# EAGLE board keyBoard_A (EAGLE 6.3), part 1 of 2
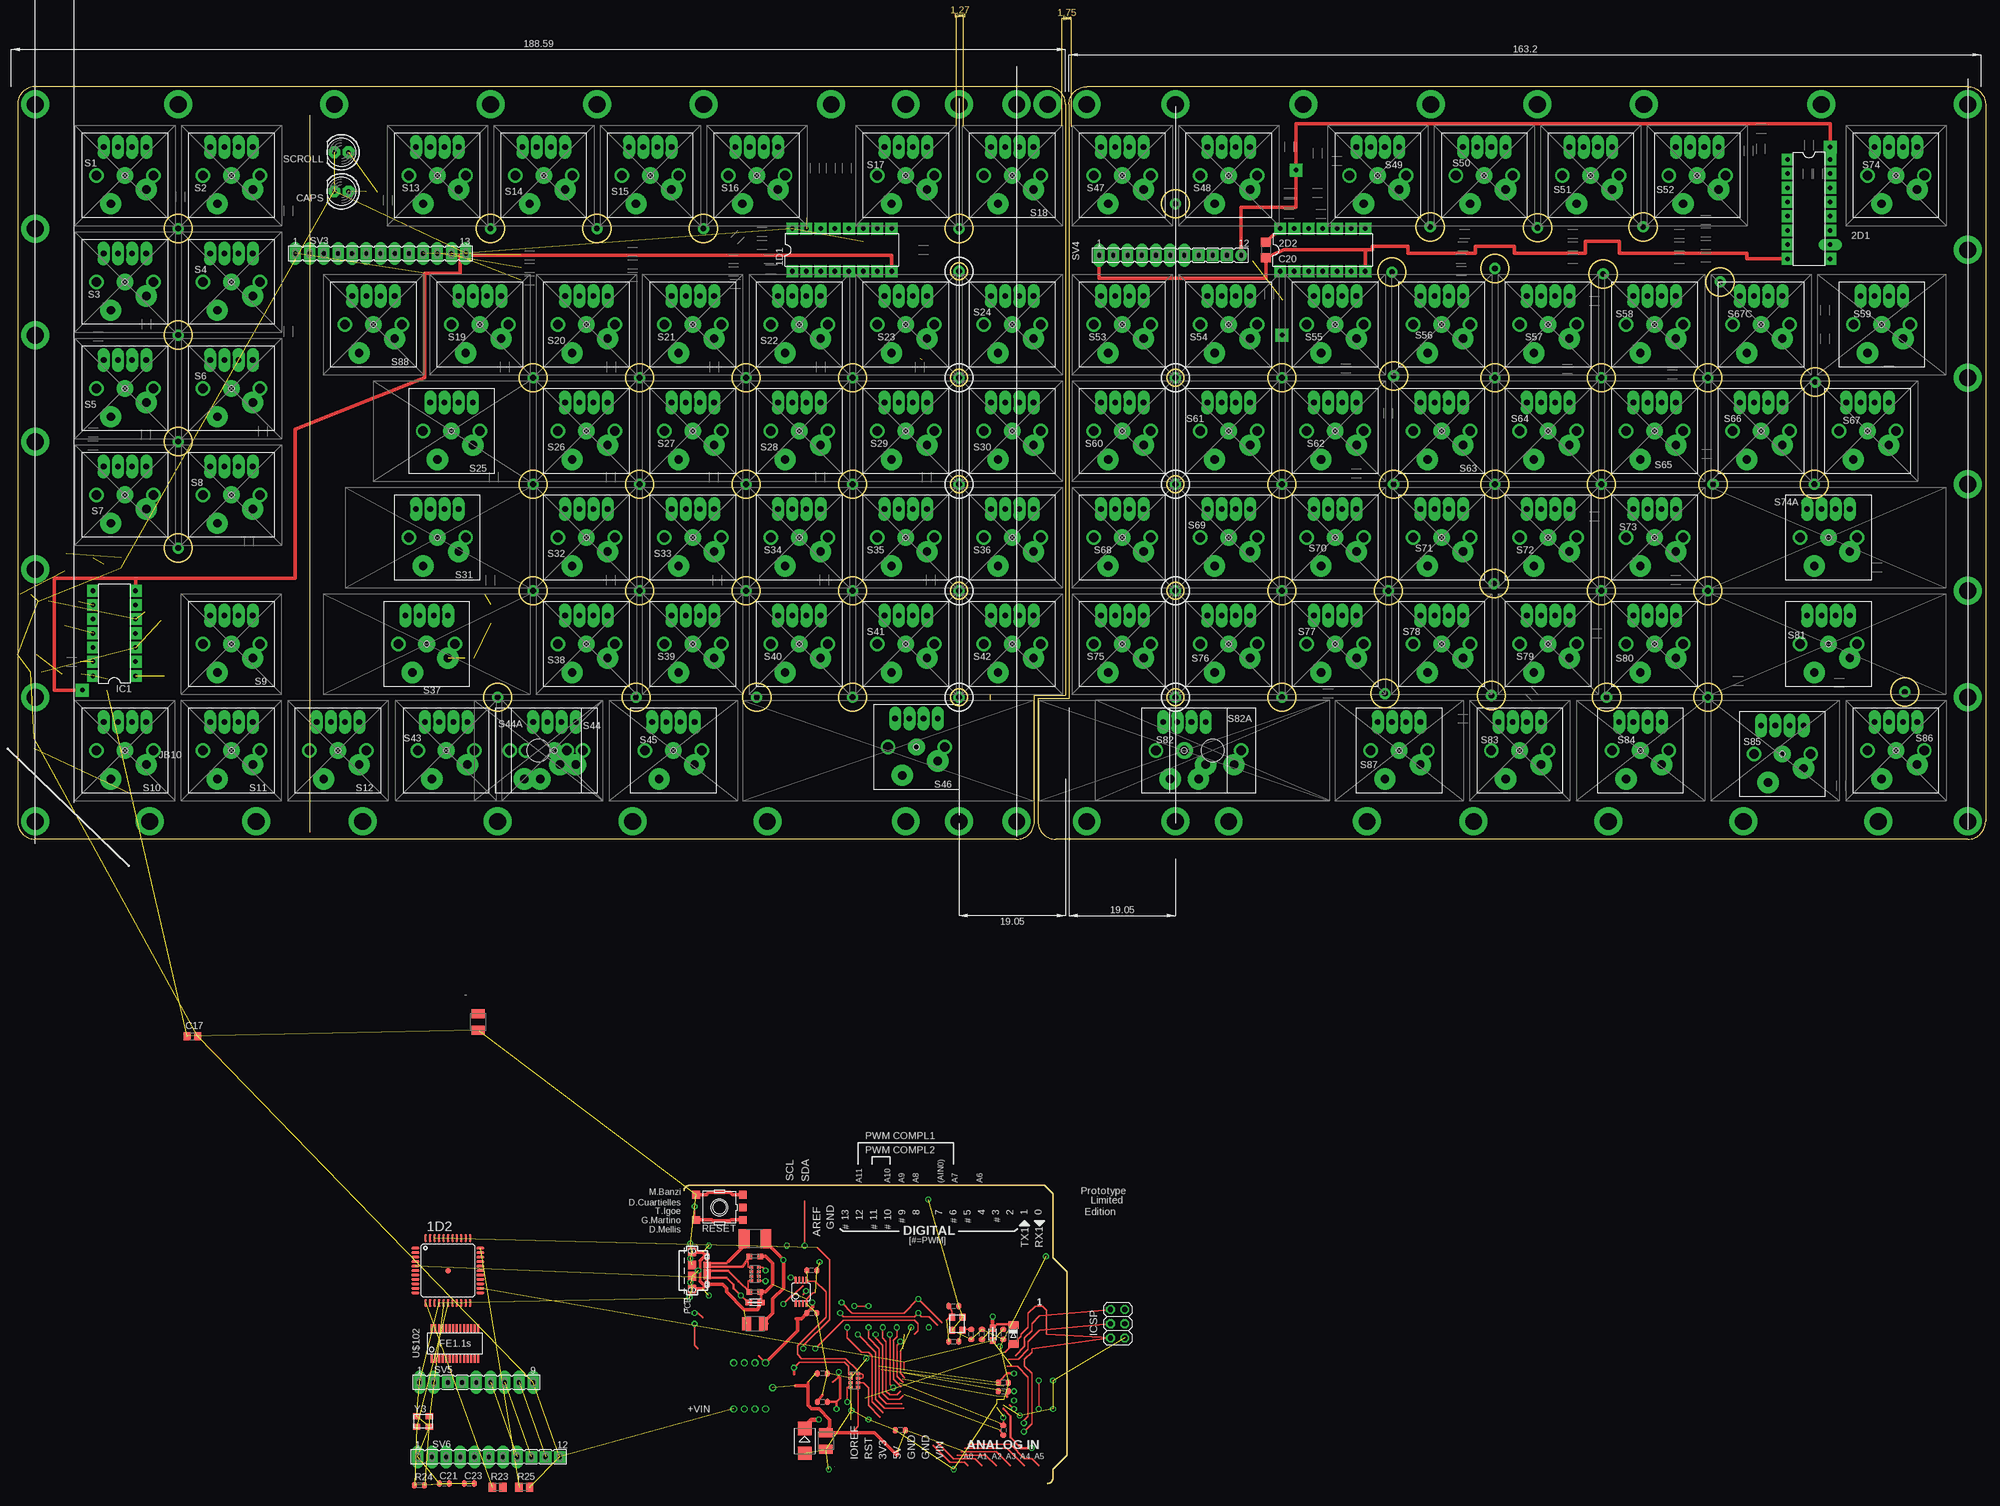
[diagram p4: board, top side]
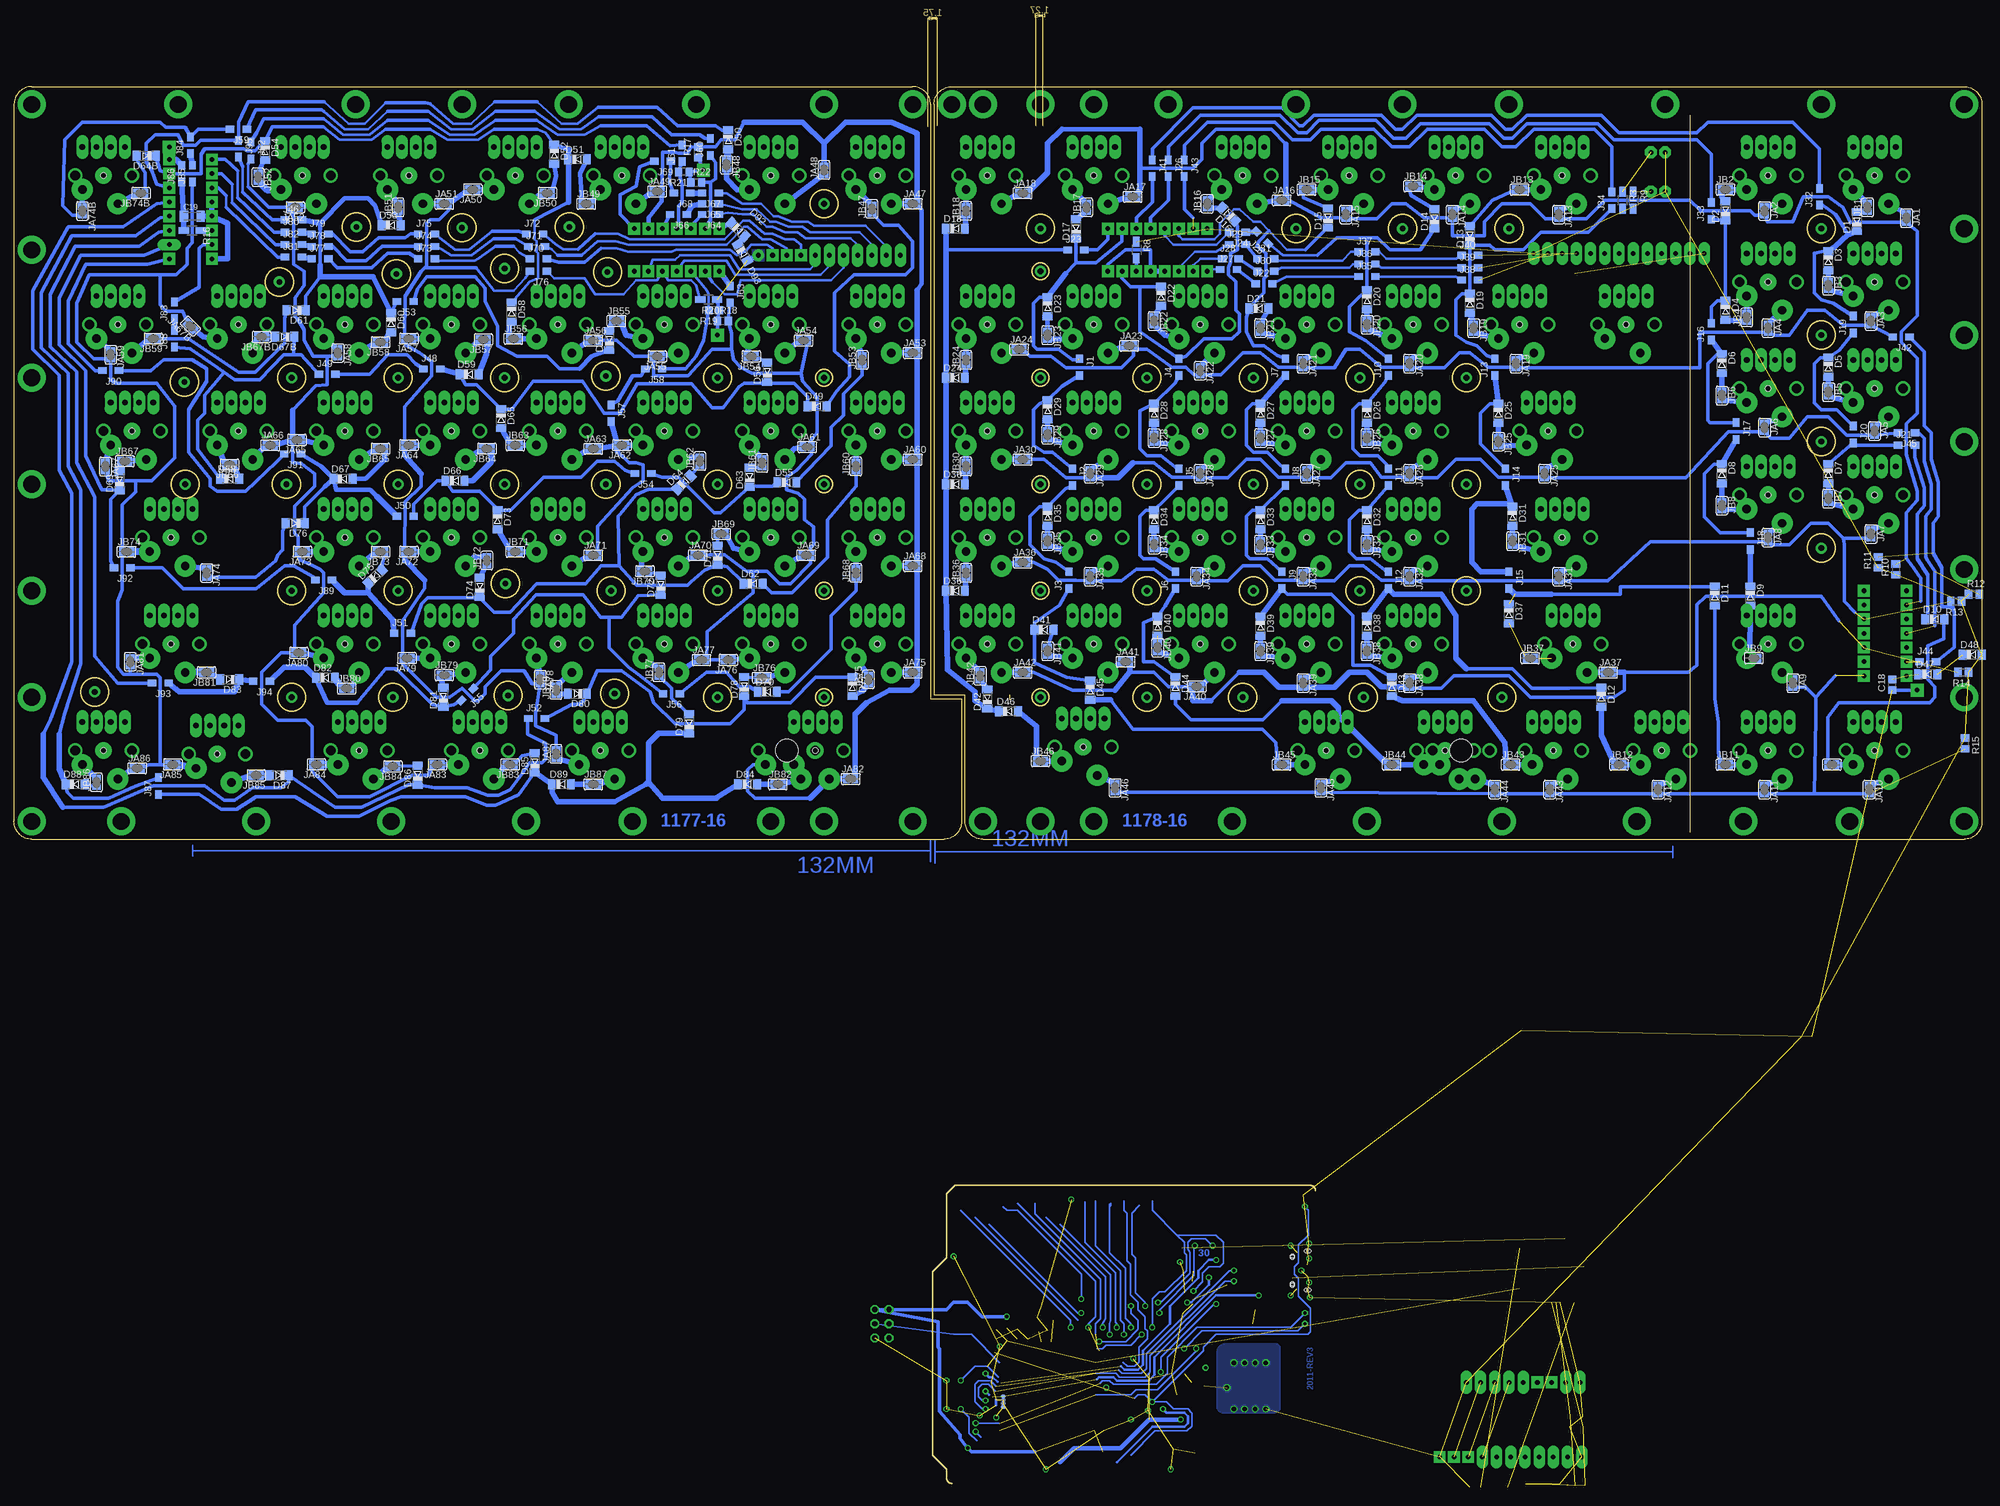
[diagram p5: board, bottom side, seen from below]

Size 352.11 x 249.87 mm. Coordinates in mm from the lower left corner, seen from the top.
Outline: 184.26,0 arc90 185.26,1 185.26,2.54 187.8,5.08 187.8,37.85 185.26,40.39 185.26,51.82 183.74,53.34 120.22,53.34 arc90 119.22,52.34
Outline: 52.23,244.79 52.23,116.52
Outline: 343.38,115.25 348.93,115.25 arc90 352.11,118.43 352.11,246.7 arc90 348.93,249.87 191.29,249.87 arc90 188.12,246.7 188.12,140.33 182.56,140.33 182.56,121.76 182.56,118.43 arc90 185.74,115.25 343.38,115.25
Outline: 343.38,115.25 191.29,115.25
Outline: 173.99,141.13 173.99,140.18
Outline: 187.48,246.7 187.48,140.97 181.93,140.97 181.93,121.13 181.93,118.43 arc-90 178.75,115.25 3.17,115.25 arc-90 0,118.43 0,246.7 arc-90 3.17,249.87 184.31,249.87 arc-90 187.48,246.7
Outline: circle at 168.43,159.7 radius 1.5
Outline: circle at 168.43,140.65 radius 1.5
Outline: circle at 149.38,140.65 radius 2.5
Outline: circle at 168.43,178.75 radius 1.5
Outline: circle at 168.43,197.8 radius 1.5
Outline: circle at 149.38,197.8 radius 2.5
Outline: circle at 149.38,178.75 radius 2.5
Outline: circle at 149.38,159.7 radius 2.5
Outline: circle at 132.24,140.65 radius 2.5
Outline: circle at 130.33,159.7 radius 2.5
Outline: circle at 130.33,178.75 radius 2.5
Outline: circle at 130.33,197.8 radius 2.5
Outline: circle at 111.28,197.8 radius 2.5
Outline: circle at 111.28,178.75 radius 2.5
Outline: circle at 111.28,159.7 radius 2.5
Outline: circle at 110.65,140.65 radius 2.5
Outline: circle at 92.23,159.7 radius 2.5
Outline: circle at 85.88,140.65 radius 2.5
Outline: circle at 92.23,178.75 radius 2.5
Outline: circle at 92.23,197.8 radius 2.5
Copper layers (1*16): Top 0.035mm / dielectric 1.5mm / Bottom 0.035mm
Design rules "default": minimum track width 10mil, minimum drill 24mil, track to track 8mil, track to pad 8mil, pad to pad 8mil, via to via 8mil, smd to smd 8mil, copper to edge 40mil, drill to drill 8mil, minimum pad ring 10mil, minimum via ring 8mil, stop-mask expansion 4mil, vias tented up to drill 0mil, thermal gap 10mil
Net classes: 1 power: width 0.254 mm, drill 0.61 mm, clearance 0.254 mm; 2 gnd: width 0.254 mm, drill 0.61 mm, clearance 0.254 mm; 3 usbvcc: width 0.254 mm, drill 0.61 mm, clearance 0.254 mm; 4 aref: width 0.254 mm, drill 0.61 mm, clearance 0.254 mm
vRestrict: area 237.6,16.7 to 238.2,17; area 230.9,13.3 to 231.6,13.8; area 239.6,13.3 to 240.3,13.8; area 236.4,13.3 to 236.9,13.8; area 243,-11.6 to 243.6,-11.1; area 245.5,-11.7 to 246,-10.9

## Footprints (pad centres in the part's own frame; a part is rotated, then mirrored left to right if it is on the bottom)
DIL16 = drill 0.813 pad 2.1 square: 1 -8.89,-3.81; 2 -6.35,-3.81; 3 -3.81,-3.81; 4 -1.27,-3.81; 5 1.27,-3.81; 6 3.81,-3.81; 7 6.35,-3.81; 8 8.89,-3.81; 9 8.89,3.81; 10 6.35,3.81; 11 3.81,3.81; 12 1.27,3.81; 13 -1.27,3.81; 14 -3.81,3.81; 15 -6.35,3.81; 16 -8.89,3.81
SMARTPRJ_TQFP44-PAD = smd 1.4 x 0.45: 1 -5.8,4; 2 -5.8,3.2; 3 -5.8,2.4; 4 -5.8,1.6; 5 -5.8,0.8; 6 -5.8,0; 7 -5.8,-0.8; 8 -5.8,-1.6; 9 -5.8,-2.4; 10 -5.8,-3.2; 11 -5.8,-4; 23 5.8,-4; 24 5.8,-3.2; 25 5.8,-2.4; 26 5.8,-1.6; 27 5.8,-0.8; 28 5.8,0; 29 5.8,0.8; 30 5.8,1.6; 31 5.8,2.4; 32 5.8,3.2; 33 5.8,4 | smd 0.45 x 1.4: 12 -4,-5.8; 13 -3.2,-5.8; 14 -2.4,-5.8; 15 -1.6,-5.8; 16 -0.8,-5.8; 17 0,-5.8; 18 0.8,-5.8; 19 1.6,-5.8; 20 2.4,-5.8; 21 3.2,-5.8; 22 4,-5.8; 34 4,5.8; 35 3.2,5.8; 36 2.4,5.8; 37 1.6,5.8; 38 0.8,5.8; 39 0,5.8; 40 -0.8,5.8; 41 -1.6,5.8; 42 -2.4,5.8; 43 -3.2,5.8; 44 -4,5.8 | smd 1 x 1: P$1 0,0
DIL16' = drill 0.813 pad 2.1 square: 1 -8.89,-3.81; 2 -6.35,-3.81; 3 -3.81,-3.81; 4 -1.27,-3.81; 5 1.27,-3.81; 6 3.81,-3.81; 7 6.35,-3.81; 8 8.89,-3.81; 9 8.89,3.81; 11 3.81,3.81; 12 1.27,3.81; 13 -1.27,3.81; 14 -3.81,3.81; 15 -6.35,3.81; 16 -8.89,3.81 | drill 0.813 pad 2.1 long: 10 6.35,3.81
DIL14 = drill 0.813 pad 2.1 square: 1 -7.62,-3.81; 2 -5.08,-3.81; 3 -2.54,-3.81; 4 0,-3.81; 5 2.54,-3.81; 6 5.08,-3.81; 7 7.62,-3.81; 8 7.62,3.81; 9 5.08,3.81; 10 2.54,3.81; 11 0,3.81; 12 -2.54,3.81; 13 -5.08,3.81; 14 -7.62,3.81
C0603-ROUND = smd 0.898 x 1.1: 1 -0.889,0; 2 0.889,0
SMC_B = smd 1.6 x 2.4: + -1.5,0; - 1.5,0
C0805 = smd 1.3 x 1.5: 1 -0.95,0; 2 0.95,0
C1206K = smd 1.5 x 2: 1 -1.5,0; 2 1.5,0
C1206 = smd 1.6 x 1.8: 1 -1.4,0; 2 1.4,0
LED5MM = drill 0.813 pad 2.1 octagon: A -1.27,0; K 1.27,0
SOD80C = smd 1.4 x 1.8 bottom: A -1.7,0; C 1.7,0
SMB = smd 2.4 x 2.4: A 2.2,0; C -2.2,0
MINIMELF = smd 1.4 x 1.8: A 1.7,0; C -1.7,0
L1812 = smd 1.9 x 3.4: 1 -1.95,0; 2 1.95,0
MSOP08 = smd 0.3 x 1.2: 1 -0.976,-2.113; 2 -0.326,-2.113; 3 0.324,-2.113; 4 0.974,-2.113; 5 0.974,2.112; 6 0.324,2.112; 7 -0.326,2.112; 8 -0.976,2.112
2X03 = drill 0.95 pad 1.55 octagon: 1 -2.54,-1.27; 2 -2.54,1.27; 3 0,-1.27; 4 0,1.27; 5 2.54,-1.27; 6 2.54,1.27
R1206W = smd 1.5 x 1.2 bottom: 1 1.499,0; 2 -1.499,0
CON2_USB_MICRO_B_AT = smd 0.406 x 1.346: P1 -1.321,2.692; P2 -0.66,2.692; P3 0,2.692; P4 0.66,2.692; P5 1.321,2.692 | smd 1.651 x 1.549: S1 -3.302,0; S2 3.302,0 | smd 1.524 x 1.016: S3 -2.489,2.692; S4 2.489,2.692 | smd 1.524 x 1.524: S5 -1.016,0; S6 1.016,0 | hole 0.7: -3.505,0.254; -3.505,-0.254; 3.505,0.254; 3.505,-0.254; -2.616,2.692; -2.362,2.692; 2.362,2.692; 2.616,2.692
SJ = smd 1.168 x 1.6 bottom: 1 0.762,0; 2 -0.762,0
SJ' = smd 1.168 x 1.6: 1 -0.762,0; 2 0.762,0
0805 = smd 1.2 x 1: 1 -1.1,0; 2 1.1,0
R1206W' = smd 1.8 x 1.2: 1 -1.499,0; 2 1.499,0
R0603-ROUND = smd 0.898 x 1.1: 1 -0.889,0; 2 0.889,0
R0402 = smd 0.7 x 0.9: 1 -0.65,0; 2 0.65,0
M0805 = smd 1.3 x 1.6: 1 -0.95,0; 2 0.95,0
R0805 = smd 1.3 x 1.5: 1 -0.95,0; 2 0.95,0
TS42 = smd 1.6 x 1.4: 1 -4.2,2.25; 2 4.2,2.25; 3 -4.2,-2.25; 4 4.2,-2.25; 5 -4.2,0
CAY16 = smd 0.5 x 0.65: 1 -1.2,-0.675; 2 -0.4,-0.675; 3 0.4,-0.675; 4 1.2,-0.675; 5 1.2,0.675; 6 0.4,0.675; 7 -0.4,0.675; 8 -1.2,0.675
CHERRY-MX-4P = drill 1.016 pad 2.184 long: D1 -3.81,-5.08; D2 3.81,-5.08; LED1 -1.27,-5.08; LED2 1.27,-5.08 | drill 1 pad 3: P$1 0,0 | drill 1.714 pad 1.93: P$3 -5.08,0; P$4 5.08,0 | drill 1.5 pad 3.81: SW1 -3.81,2.54; SW2 2.54,5.08 | hole 1: 0,0
CHERRY-MX = drill 0.8: P$1 0,0 | drill 1.714 pad 1.93: P$3 -5.08,0; P$4 5.08,0 | drill 1.5 pad 3.81: SW1 -3.81,2.54; SW2 2.54,5.08 | hole 4: 0,0
FE13 = drill 0.813 pad 2.1 long: 1 -15.24,0; 2 -12.7,0; 3 -10.16,0; 4 -7.62,0; 5 -5.08,0; 6 -2.54,0; 7 0,0; 8 2.54,0; 9 5.08,0; 10 7.62,0; 11 10.16,0; 12 12.7,0; 13 15.24,0
FE12 = drill 0.813 pad 2.1 long: 1 -13.97,0; 2 -11.43,0; 3 -8.89,0; 4 -6.35,0; 5 -3.81,0; 6 -1.27,0; 7 1.27,0 | drill 0.813 pad 2.1 square: 8 3.81,0; 9 6.35,0; 10 8.89,0 | drill 0.813 pad 2.1: 11 11.43,0
FE09 = drill 0.813 pad 2.1 long: 1 -10.16,0; 2 -7.62,0; 5 0,0; 6 2.54,0; 7 5.08,0; 8 7.62,0; 9 10.16,0 | drill 0.813 pad 2.1 square: 3 -5.08,0; 4 -2.54,0
FE12' = drill 0.813 pad 2.1 long: 1 -13.97,0; 2 -11.43,0; 3 -8.89,0; 4 -6.35,0; 5 -3.81,0; 6 -1.27,0; 7 1.27,0; 8 3.81,0 | drill 0.813 pad 2.1 square: 9 6.35,0; 10 8.89,0; 11 11.43,0
FE1.1S_SSOP-28 = smd 0.35 x 1.5: 1 -4.16,-2.7; 2 -3.52,-2.7; 3 -2.88,-2.7; 4 -2.24,-2.7; 5 -1.6,-2.7; 6 -0.96,-2.7; 7 -0.32,-2.7; 8 0.32,-2.7; 9 0.96,-2.7; 10 1.6,-2.7; 11 2.24,-2.7; 12 2.88,-2.7; 13 3.52,-2.7; 14 4.16,-2.7; 15 4.16,2.7; 16 3.52,2.7; 17 2.88,2.7; 18 2.24,2.7; 19 1.6,2.7; 20 0.96,2.7; 21 0.32,2.7; 22 -0.3,2.7; 23 -0.96,2.7; 24 -1.6,2.7; 25 -2.24,2.7; 26 -2.88,2.7; 27 -3.52,2.7; 28 -4.16,2.7
CRYSTAL-3.2-2.5 = smd 1.3 x 1.05: 1 -1.15,-0.925; 2 1.15,-0.925; 3 1.15,0.925; 4 -1.15,0.925
CT/CN0603 = smd 1 x 1: 1 -1,0; 2 1,0

## Placement (x,y rotation side)
1D1  74HC138N  [DIL16]  147.48,220.66 0 top
1D2  ATMEGA32U4  [SMARTPRJ_TQFP44-PAD]  76.99,38.1 0 top
2D1  74HC138N  [DIL16']  320.52,227.96 270 top
2D2  74HC04N  [DIL14]  233.52,220.66 0 top
C3  100n  [C0603-ROUND]  172.56,26.67 90 top
C4  100n  [C0603-ROUND]  157.96,9.52 180 top
C5  1uF  [C0603-ROUND]  176.37,26.67 270 top
C6  100n  [C0603-ROUND]  176.37,9.52 270 top
C7  1uF  [C0603-ROUND]  176.37,16.51 0 top
C8  10u  [SMC_B]  131.92,28.57 180 top
C9  100n  [C0603-ROUND]  176.37,18.03 180 top
C10  10u  [SMC_B]  82.39,82.55 270 top
C11  1u  [C0603-ROUND]  143.99,19.69 180 top
C12  10u  [SMC_B]  144.62,7.62 270 top
C13  100n  [C0603-ROUND]  142.08,30.48 0 top
C14  1u  [C0603-ROUND]  143.99,14.6 0 top
C15  22p  [C0603-ROUND]  170.66,26.67 90 top
C16  22p  [C0603-ROUND]  167.48,31.75 0 top
C17  100n  [C0805]  31.27,80.01 0 top
C18  100n  [C0805]  16.03,142.88 90 bottom
C19  100n  [C1206K]  320.2,226.69 0 bottom
C20  100n  [C1206]  223.36,220.66 270 top
C21  22p  [C0603-ROUND]  76.36,0 0 top
C22  100n  [C0603-ROUND]  142.08,38.1 180 top
C23  22p  [C0603-ROUND]  80.8,0 0 top
CAPS  [LED5MM]  57.94,231.14 180 top
D1  LL4148  [SOD80C]  22.38,225.74 270 top
D2  LL4148  [SOD80C]  45.88,227.65 270 top
D3  LL4148  [SOD80C]  27.46,218.76 90 top
D4  LL4148  [SOD80C]  45.88,209.87 90 top
D5  LL4148  [SOD80C]  27.46,199.71 90 top
D6  LL4148  [SOD80C]  46.51,200.34 90 top
D7  LL4148  [SOD80C]  27.46,180.66 90 top
D8  LL4148  [SOD80C]  46.51,180.66 90 top
D9  LL4148  [SOD80C]  41.43,158.75 90 top
D10  LL4148  [SOD80C]  8.41,154.62 0 top
D11  LL4148  [SOD80C]  47.78,158.75 90 top
D12  LL4148  [SOD80C]  68.1,140.65 90 top
D13  LL4148  [SOD80C]  91.6,223.2 270 top
D14  LL4148  [SOD80C]  97.95,226.22 270 top
D15  LL4148  [SOD80C]  117,226.38 270 top
D16  LL4148  [SOD80C]  134.78,227.01 225 top
D17  LL4148  [SOD80C]  162.08,224.47 270 top
D18  LL4148  [SOD80C]  183.67,224.47 0 top
D19  LL4148  [SOD80C]  91.6,211.14 90 top
D20  LL4148  [SOD80C]  110.01,211.77 90 top
D21  LL4148  [SOD80C]  129.38,210.19 0 top
D22  LL4148  [SOD80C]  146.84,212.41 90 top
D23  LL4148  [SOD80C]  167.16,210.5 90 top
D24  LL4148  [SOD80C]  183.67,197.8 0 top
D25  LL4148  [SOD80C]  86.52,191.45 90 top
D26  LL4148  [SOD80C]  110.01,191.45 90 top
D27  LL4148  [SOD80C]  129.06,191.45 90 top
D28  LL4148  [SOD80C]  148.11,191.45 90 top
D29  LL4148  [SOD80C]  167.16,192.09 90 top
D30  LL4148  [SOD80C]  183.67,178.75 0 top
D31  LL4148  [SOD80C]  83.98,173.04 90 top
D32  LL4148  [SOD80C]  110.01,172.4 90 top
D33  LL4148  [SOD80C]  129.06,172.4 90 top
D34  LL4148  [SOD80C]  148.11,172.4 90 top
D35  LL4148  [SOD80C]  167.16,173.04 90 top
D36  LL4148  [SOD80C]  183.67,159.7 0 top
D37  LL4148  [SOD80C]  84.61,155.57 90 top
D38  LL4148  [SOD80C]  110.01,153.35 90 top
D39  LL4148  [SOD80C]  129.06,153.35 90 top
D40  LL4148  [SOD80C]  147.48,153.35 90 top
D41  LL4148  [SOD80C]  167.8,152.72 0 top
D42  LL4148  [SOD80C]  177.96,140.33 270 top
D43  LL4148  [SOD80C]  105.57,142.56 90 top
D44  LL4148  [SOD80C]  144.3,142.56 90 top
D45  LL4148  [SOD80C]  159.54,141.92 90 top
D46  LL4148  [SOD80C]  174.15,138.11 0 top
D47  LL4148  [SOD80C]  9.68,144.78 0 top
D48  LL4148  [SOD80C]  1.75,148.27 0 top
D49  LL4148  [SOD80C]  208.44,192.72 0 top
D50  LL4148  [SOD80C]  224.31,240.35 90 top
D51  LL4148  [SOD80C]  251.3,236.85 0 top
D52  LL4148  [SOD80C]  255.43,237.81 90 top
D53  LL4148  [SOD80C]  284.64,225.11 0 top
D54  LL4148  [SOD80C]  307.18,238.44 90 top
D55  LL4148  [SOD80C]  213.84,179.07 0 top
D56  LL4148  [SOD80C]  217.33,198.75 270 top
D57  LL4148  [SOD80C]  245.59,204.47 270 top
D58  LL4148  [SOD80C]  263.05,209.55 90 top
D59  LL4148  [SOD80C]  270.67,198.44 0 top
D60  LL4148  [SOD80C]  284.64,207.64 90 top
D61  LL4148  [SOD80C]  301.62,209.87 180 top
D62  LL4148  [SOD80C]  219.87,160.97 0 top
D63  LL4148  [SOD80C]  220.5,180.02 270 top
D64  LL4148  [SOD80C]  232.25,179.07 315 top
D64B  LL4148  [SOD80C]  328.45,237.49 180 top
D65  LL4148  [SOD80C]  264.95,190.5 90 top
D66  LL4148  [SOD80C]  273.21,179.39 0 top
D67  LL4148  [SOD80C]  293.21,179.7 0 top
D67B  LL4148  [SOD80C]  303.69,205.1 180 top
D68  LL4148  [SOD80C]  313.53,179.7 0 top
D69  LL4148  [SOD80C]  333.22,179.39 270 top
D70  LL4148  [SOD80C]  217.33,141.6 0 top
D71  LL4148  [SOD80C]  226.22,166.05 270 top
D72  LL4148  [SOD80C]  236.38,160.65 270 top
D73  LL4148  [SOD80C]  265.59,172.4 90 top
D74  LL4148  [SOD80C]  268.76,160.34 270 top
D75  LL4148  [SOD80C]  287.5,162.24 315 top
D76  LL4148  [SOD80C]  301.78,171.77 180 top
D77  LL4148  [SOD80C]  202.09,142.56 90 top
D78  LL4148  [SOD80C]  221.46,142.56 270 top
D79  LL4148  [SOD80C]  231.3,135.89 270 top
D80  LL4148  [SOD80C]  251.3,141.29 180 top
D81  LL4148  [SOD80C]  275.27,140.65 270 top
D82  LL4148  [SOD80C]  296.39,144.14 0 top
D83  LL4148  [SOD80C]  313.53,143.83 180 top
D84  LL4148  [SOD80C]  220.82,125.09 0 top
D85  LL4148  [SOD80C]  258.92,128.9 270 top
D86  LL4148  [SOD80C]  279.88,126.68 270 top
D87  LL4148  [SOD80C]  304.64,126.68 180 top
D88  LL4148  [SOD80C]  341.15,125.09 0 top
D89  LL4148  [SOD80C]  254.16,125.09 0 top
D90  M7  [SMB]  140.81,7.62 270 top
D91  CD1206-S01575  [MINIMELF]  178.15,26.67 270 top
D92  LL4148  [SOD80C]  222.57,224.31 45 top
D93  LL4148  [SOD80C]  221.77,220.19 60 top
F1  MF-MSMF050-2 500mA  [L1812]  131.92,43.81 180 top
IC1  74HC04N  [DIL14]  17.3,152.08 90 top
IC2  LMV358IDGKR  [MSOP08]  140.18,34.29 0 top
ICSP  ICSP  [2X03]  196.82,28.57 270 top
J1  J  [R1206W]  161.45,199.71 90 top
J2  J  [R1206W]  162.72,180.02 90 top
J3  J  [R1206W]  163.35,161.61 270 top
J4  J  [R1206W]  143.67,199.71 270 top
J5  J  [R1206W]  143.67,180.02 90 top
J6  J  [R1206W]  144.3,161.61 270 top
J7  J  [R1206W]  124.62,199.71 270 top
J8  J  [R1206W]  124.62,180.02 90 top
J9  J  [R1206W]  125.25,161.61 90 top
J10  J  [R1206W]  106.2,199.71 270 top
J11  J  [R1206W]  106.2,180.02 90 top
J12  J  [R1206W]  106.2,161.61 90 top
J13  J  [R1206W]  87.15,199.71 270 top
J14  J  [R1206W]  85.25,180.02 90 top
J15  J  [R1206W]  84.61,161.61 90 top
J16  J  [R1206W]  48.42,206.06 270 top
J17  J  [R1206W]  43.97,188.28 90 top
J18  J  [R1206W]  41.43,168.59 90 top
J19  J  [R1206W]  23.02,207.33 270 top
J20  J  [R1206W]  23.02,187.64 90 top
J21  J  [R1206W]  13.49,185.74 0 top
J22  J  [R1206W]  128.43,214.63 0 top
J23  J  [R1206W]  162.08,220.66 0 top
J24  J  [R1206W]  133.19,223.84 180 top
J25  J  [R1206W]  128.75,222.88 225 top
J26  J  [R1206W]  145.57,235.27 90 top
J27  J  [R1206W]  134.78,217.17 0 top
J28  J  [R1206W]  134.46,219.07 0 top
J29  J  [R1206W]  133.19,221.62 0 top
J30  J  [R1206W]  128.11,216.85 0 top
J31  J  [R1206W]  128.11,219.07 0 top
J32  J  [R1206W]  29.05,230.19 270 top
J33  J  [R1206W]  48.42,227.65 270 top
J34  J  [R1206W]  66.2,229.55 270 top
J35  J  [R1206W]  110.01,215.9 0 top
J36  J  [R1206W]  110.01,218.12 0 top
J37  J  [R1206W]  110.01,220.34 0 top
J38  J  [R1206W]  91.6,215.26 0 top
J39  J  [R1206W]  91.6,217.49 0 top
J40  J  [R1206W]  91.6,219.71 0 top
J41  J  [R1206W]  148.43,235.27 90 top
J42  J  [R1206W]  14.45,205.1 180 top
J43  J  [R1206W]  142.72,235.27 90 top
J44  J  [R1206W]  9.68,147 0 top
J45  J  [R1206W]  13.49,187.96 180 top
J46  [R1206W]  302.1,226.06 0 top
J47  USB MICRO  [CON2_USB_MICRO_B_AT]  120.67,38.1 270 top
J48  [R1206W]  277.34,199.39 0 top
J49  [R1206W]  296.07,198.44 0 top
J50  [R1206W]  282.1,173.04 0 top
J51  [R1206W]  282.57,152.08 0 top
J52  [R1206W]  258.6,136.84 0 top
J53  [R1206W]  282.1,211.45 180 top
J54  [R1206W]  239.55,180.66 180 top
J55  [R1206W]  270.99,141.13 135 top
J56  [R1206W]  234.47,141.29 180 top
J57  [R1206W]  245.27,191.45 90 top
J58  [R1206W]  237.65,199.39 180 top
J59  [R1206W]  311.94,242.25 180 top
J60  [R1206W]  227.49,239.08 270 top
J61  [R1206W]  232.57,237.97 270 top
J62  [R1206W]  309.72,238.44 90 top
J63  [R1206W]  224,212.72 90 top
J64  [R1206W]  227.49,227.01 180 top
J65  [R1206W]  227.49,228.92 180 top
J66  [R1206W]  233.2,227.01 180 top
J67  [R1206W]  227.49,230.82 180 top
J68  [R1206W]  232.57,230.82 180 top
J69  [R1206W]  236.06,236.54 180 top
J70  [R1206W]  258.29,219.07 0 top
J71  [R1206W]  258.6,221.3 0 top
J72  [R1206W]  258.92,223.52 0 top
J73  [R1206W]  278.29,219.07 0 top
J74  [R1206W]  278.29,221.3 0 top
J75  [R1206W]  278.29,223.52 0 top
J76  [R1206W]  258.29,216.85 180 top
J77  [R1206W]  297.34,219.07 0 top
J78  [R1206W]  297.34,221.3 0 top
J79  [R1206W]  297.34,223.52 0 top
J80  [R1206W]  302.1,223.84 0 top
J81  [R1206W]  302.1,219.39 0 top
J82  [R1206W]  302.1,221.62 0 top
J83  [R1206W]  323.37,209.87 270 top
J84  [R1206W]  320.52,239.39 270 top
J85  [R1206W]  320.2,234.31 270 top
J86  [R1206W]  322.1,234.31 270 top
J87  [R1206W]  326.23,124.78 270 top
J88  [R1206W]  323.37,204.79 270 top
J89  [R1206W]  296.7,161.61 180 top
J90  [R1206W]  334.8,199.07 180 top
J91  [R1206W]  302.26,184.15 180 top
J92  [R1206W]  332.74,163.83 180 top
J93  [R1206W]  325.91,143.19 180 top
J94  [R1206W]  307.82,143.51 180 top
J95  [R1206W]  311.94,238.76 90 top
JA1  [SJ]  13.49,226.38 90 top
JA2  [SJ]  38.89,227.65 90 top
JA3  [SJ]  19.84,207.96 90 top
JA4  [SJ]  38.26,206.69 90 top
JA5  [SJ]  19.21,188.28 90 top
JA6  [SJ]  38.89,188.91 90 top
JA7  [SJ]  19.84,169.86 90 top
JA8  [SJ]  38.26,169.23 90 top
JA9  [SJ]  33.81,143.19 90 top
JA10  [SJ]  20.16,124.14 90 top
JA11  [SJ]  38.89,124.14 90 top
JA12  [SJ]  57.94,124.14 90 top
JA13  [SJ]  75.72,227.01 90 top
JA14  [SJ]  94.77,227.01 90 top
JA15  [SJ]  113.82,227.01 90 top
JA16  [SJ]  125.25,229.55 0 top
JA17  [SJ]  151.92,230.19 0 top
JA18  [SJ]  171.61,230.82 0 top
JA19  [SJ]  83.34,200.34 90 top
JA20  [SJ]  102.39,200.34 90 top
JA21  [SJ]  121.44,200.34 90 top
JA22  [SJ]  139.86,199.07 90 top
JA23  [SJ]  152.56,203.52 0 top
JA24  [SJ]  172.24,202.88 0 top
JA25  [SJ]  78.26,180.66 90 top
JA26  [SJ]  102.39,180.66 90 top
JA27  [SJ]  120.81,180.66 90 top
JA28  [SJ]  139.86,180.66 90 top
JA29  [SJ]  159.54,180.66 90 top
JA30  [SJ]  171.61,183.2 0 top
JA31  [SJ]  75.72,162.24 90 top
JA32  [SJ]  102.39,162.24 90 top
JA33  [SJ]  121.44,162.24 90 top
JA34  [SJ]  140.49,162.24 90 top
JA35  [SJ]  159.54,162.24 90 top
JA36  [SJ]  171.61,164.78 0 top
JA37  [SJ]  66.83,145.1 0 top
JA38  [SJ]  102.39,143.19 90 top
JA39  [SJ]  121.44,143.19 90 top
JA40  [SJ]  140.49,142.56 180 top
JA41  [SJ]  153.19,147 0 top
JA42  [SJ]  171.61,145.1 0 top
JA43  [SJ]  77.31,124.14 90 top
JA44  [SJ]  87.15,124.14 90 top
JA45  [SJ]  118.27,124.46 90 top
JA46  [SJ]  155.1,124.46 90 top
JA47  [SJ]  191.29,228.92 0 top
JA48  [SJ]  207.17,234.95 270 top
JA49  [SJ]  237.01,231.14 0 top
JA50  [SJ]  270.03,231.46 180 top
JA51  [SJ]  275.11,228.92 0 top
JA52  [SJ]  301.78,228.28 180 top
JA53  [SJ]  191.29,202.25 0 top
JA54  [SJ]  210.82,204.47 0 top
JA55  [SJ]  237.01,201.61 180 top
JA56  [SJ]  248.44,204.47 0 top
JA57  [SJ]  281.46,204.79 180 top
JA58  [SJ]  294.16,202.25 90 top
JA59  [SJ]  334.8,201.93 90 top
JA60  [SJ]  191.29,183.2 0 top
JA61  [SJ]  210.18,185.42 0 top
JA62  [SJ]  243.36,185.74 180 top
JA63  [SJ]  248.44,185.1 0 top
JA64  [SJ]  281.46,185.74 180 top
JA65  [SJ]  301.47,186.69 180 top
JA66  [SJ]  306.23,185.74 0 top
JA67  [SJ]  335.76,181.93 90 top
JA67B  [SJ]  320.52,207.01 225 top
JA68  [SJ]  191.29,164.15 0 top
JA69  [SJ]  210.34,166.05 0 top
JA70  [SJ]  229.71,166.05 0 top
JA71  [SJ]  248.44,166.05 0 top
JA72  [SJ]  281.46,166.69 180 top
JA73  [SJ]  300.51,166.69 180 top
JA74  [SJ]  317.66,162.88 90 top
JA74B  [SJ]  339.88,227.65 90 top
JA75  [SJ]  191.29,145.1 0 top
JA76  [SJ]  224.31,147.32 180 top
JA77  [SJ]  229.08,147.32 0 top
JA78  [SJ]  257.97,143.83 90 top
JA79  [SJ]  281.78,147.64 180 top
JA80  [SJ]  301.15,148.59 180 top
JA81  [SJ]  331.31,147 90 top
JA82  [SJ]  202.41,126.05 0 top
JA83  [SJ]  276.38,128.59 180 top
JA84  [SJ]  297.97,128.59 180 top
JA85  [SJ]  323.69,128.59 180 top
JA86  [SJ]  330.04,127.95 0 top
JA87  [SJ]  255.11,130.49 270 top
JB1  [SJ]  20.48,228.28 270 top
JB2  [SJ']  45.88,231.46 0 bottom
JB3  [SJ]  27.46,214.31 90 top
JB4  [SJ]  42.07,208.6 270 top
JB5  [SJ']  27.46,195.26 270 bottom
JB6  [SJ]  46.51,194.63 90 top
JB7  [SJ]  27.46,176.21 90 top
JB8  [SJ]  46.51,174.94 90 top
JB9  [SJ]  40.8,147.64 0 top
JB10  [SJ]  26.83,128.59 0 top
JB11  [SJ]  45.88,128.59 0 top
JB12  [SJ]  64.93,128.59 0 top
JB13  [SJ]  82.71,231.46 0 top
JB14  [SJ']  101.76,232.09 0 bottom
JB15  [SJ']  120.81,231.46 0 bottom
JB16  [SJ]  138.59,228.92 270 top
JB17  [SJ]  160.18,228.28 270 top
JB18  [SJ]  181.77,227.65 270 top
JB19  [SJ]  90.96,206.69 90 top
JB20  [SJ]  110.01,207.33 90 top
JB21  [SJ]  129.06,206.69 90 top
JB22  [SJ]  148.11,207.96 90 top
JB23  [SJ]  167.16,205.42 90 top
JB24  [SJ]  181.77,200.98 270 top
JB25  [SJ]  86.52,186.37 90 top
JB26  [SJ]  110.01,187.01 90 top
JB27  [SJ]  129.06,187.01 90 top
JB28  [SJ]  148.11,187.01 90 top
JB29  [SJ]  167.16,187.64 90 top
JB30  [SJ]  181.77,181.93 270 top
JB31  [SJ]  83.98,168.59 90 top
JB32  [SJ]  110.01,167.96 90 top
JB33  [SJ]  129.06,167.96 90 top
JB34  [SJ]  148.11,167.96 90 top
JB35  [SJ]  167.16,168.59 90 top
JB36  [SJ]  181.77,162.88 270 top
JB37  [SJ]  80.8,147.64 0 top
JB38  [SJ]  110.01,148.91 90 top
JB39  [SJ]  129.06,148.91 90 top
JB40  [SJ]  147.48,149.54 90 top
JB41  [SJ]  167.16,148.91 90 top
JB42  [SJ]  179.23,144.46 270 top
JB43  [SJ]  84.3,128.59 0 top
JB44  [SJ]  105.57,128.59 0 top
JB45  [SJ]  125.25,128.59 0 top
JB46  [SJ]  168.43,129.22 0 top
JB47  [SJ]  198.6,227.96 270 top
JB48  [SJ]  224.63,235.9 90 top
JB49  [SJ]  249.71,228.92 0 top
JB50  [SJ]  256.7,230.82 180 top
JB51  [SJ]  283.37,228.28 270 top
JB52  [SJ]  308.45,233.68 90 top
JB53  [SJ]  200.34,200.98 270 top
JB54  [SJ]  220.19,201.61 180 top
JB55  [SJ]  244.32,207.96 0 top
JB56  [SJ]  262.73,204.79 0 top
JB57  [SJ]  268.13,204.63 180 top
JB58  [SJ]  286.54,204.15 180 top
JB59  [SJ]  327.18,204.79 180 top
JB60  [SJ]  201.45,181.93 270 top
JB61  [SJ]  218.28,182.56 270 top
JB62  [SJ]  229.39,182.88 270 top
JB63  [SJ]  262.41,185.74 0 top
JB64  [SJ]  267.49,185.1 180 top
JB65  [SJ]  286.54,185.1 180 top
JB66  [SJ]  313.53,182.25 180 top
JB67  [SJ]  332.26,182.88 0 top
JB67B  [SJ]  307.82,205.1 180 top
JB68  [SJ]  201.45,162.88 270 top
JB69  [SJ]  225.58,169.86 0 top
JB70  [SJ]  239.24,163.19 180 top
JB71  [SJ]  262.41,166.69 0 top
JB72  [SJ]  267.49,165.1 270 top
JB73  [SJ]  286.54,166.69 180 top
JB74  [SJ]  331.95,166.69 0 top
JB74B  [SJ]  329.41,230.82 180 top
JB75  [SJ]  199.23,143.83 270 top
JB76  [SJ]  218.28,144.14 0 top
JB77  [SJ]  236.7,145.1 270 top
JB78  [SJ]  255.11,141.92 270 top
JB79  [SJ]  275.11,144.62 0 top
JB80  [SJ]  292.58,142.24 0 top
JB81  [SJ]  317.66,145.1 180 top
JB82  [SJ]  215.42,125.09 0 top
JB83  [SJ]  263.37,128.59 180 top
JB84  [SJ]  284.32,128.27 180 top
JB85  [SJ]  308.77,126.68 180 top
JB86  [SJ]  337.34,125.41 270 top
JB87  [SJ]  248.44,125.09 0 top
L1  MH2029-300Y  [0805]  174.47,26.67 270 top
L2  MH2029-300Y  [0805]  131.92,32.38 0 top
R3  [R1206W']  64.29,229.55 270 bottom
R4  1M  [R0603-ROUND]  167.48,25.4 0 top
R5  NM  [R0402]  175.1,14.33 90 bottom
R6  NM  [R0402]  175.1,14.96 90 bottom
R8  [R1206W']  151.29,220.66 270 bottom
R9  [R1206W']  62.39,229.55 270 bottom
R10  [M0805]  15.4,163.51 90 bottom
R11  [M0805]  18.57,164.78 90 bottom
R12  [M0805]  1.43,159.07 0 bottom
R13  [M0805]  4.6,157.8 180 bottom
R14  [M0805]  3.33,145.1 180 bottom
R15  [M0805]  3.02,132.4 270 bottom
R16  1k  [R1206W']  320.2,224.15 0 bottom
R17  10k  [R0805]  229.71,238.12 90 bottom
R18  10k  [R0805]  225.27,207.96 0 bottom
R19  10k  [R0805]  226.85,209.87 180 bottom
R20  10k  [R1206W']  227.81,211.77 180 bottom
R21  10k  [R0805]  232.25,234.63 180 bottom
R22  10k  [R0805]  230.03,232.73 0 bottom
R23  [M0805]  85.88,-0.63 0 top
R24  1M  [R0603-ROUND]  71.91,-0.32 0 top
R25  [M0805]  90.65,-0.63 0 top
RESET  TS42  [TS42]  125.57,49.4 180 top
RN1  10K  [CAY16]  149.7,18.41 270 top
RN3  22R  [CAY16]  131.92,37.46 90 top
S1  Scroll Lock  [CHERRY-MX-4P]  19.21,234 180 top
S2  ESC  [CHERRY-MX-4P]  38.26,234 180 top
S3  Ins  [CHERRY-MX-4P]  19.21,214.95 180 top
S4  Pause  [CHERRY-MX-4P]  38.26,214.95 180 top
S5  Home  [CHERRY-MX-4P]  19.21,195.9 180 top
S6  PageUp  [CHERRY-MX-4P]  38.26,195.9 180 top
S7  End  [CHERRY-MX-4P]  19.21,176.85 180 top
S8  PageDown  [CHERRY-MX-4P]  38.26,176.85 180 top
S9  Up  [CHERRY-MX-4P]  38.26,150.18 180 top
S10  Left  [CHERRY-MX-4P]  19.21,131.13 180 top
S11  Down  [CHERRY-MX-4P]  38.26,131.13 180 top
S12  Right  [CHERRY-MX-4P]  57.31,131.13 180 top
S13  F1  [CHERRY-MX-4P]  75.09,234 180 top
S14  F2  [CHERRY-MX-4P]  94.14,234 180 top
S15  F3  [CHERRY-MX-4P]  113.19,234 180 top
S16  F4  [CHERRY-MX-4P]  132.24,234 180 top
S17  F5  [CHERRY-MX-4P]  158.91,234 180 top
S18  F6  [CHERRY-MX-4P]  177.96,234 180 top
S19  1  [CHERRY-MX-4P]  82.71,207.33 180 top
S20  2  [CHERRY-MX-4P]  101.76,207.33 180 top
S21  3  [CHERRY-MX-4P]  120.81,207.33 180 top
S22  4  [CHERRY-MX-4P]  139.86,207.33 180 top
S23  5  [CHERRY-MX-4P]  158.91,207.33 180 top
S24  6  [CHERRY-MX-4P]  177.96,207.33 180 top
S25  TAB  [CHERRY-MX-4P]  77.63,188.28 180 top
S26  Q  [CHERRY-MX-4P]  101.76,188.28 180 top
S27  W  [CHERRY-MX-4P]  120.81,188.28 180 top
S28  E  [CHERRY-MX-4P]  139.86,188.28 180 top
S29  R  [CHERRY-MX-4P]  158.91,188.28 180 top
S30  T  [CHERRY-MX-4P]  177.96,188.28 180 top
S31  LCtrl  [CHERRY-MX-4P]  75.09,169.23 180 top
S32  A  [CHERRY-MX-4P]  101.76,169.23 180 top
S33  S  [CHERRY-MX-4P]  120.81,169.23 180 top
S34  D  [CHERRY-MX-4P]  139.86,169.23 180 top
S35  F  [CHERRY-MX-4P]  158.91,169.23 180 top
S36  G  [CHERRY-MX-4P]  177.96,169.23 180 top
S37  L Shift  [CHERRY-MX-4P]  73.18,150.18 180 top
S38  Z  [CHERRY-MX-4P]  101.76,150.18 180 top
S39  X  [CHERRY-MX-4P]  120.81,150.18 180 top
S40  C  [CHERRY-MX-4P]  139.86,150.18 180 top
S41  V  [CHERRY-MX-4P]  158.91,150.18 180 top
S42  B  [CHERRY-MX-4P]  177.96,150.18 180 top
S43  Caps Lock  [CHERRY-MX-4P]  76.68,131.13 180 top
S44  FN1  [CHERRY-MX-4P]  96.04,131.13 180 top
S44A  Fn1  [CHERRY-MX]  93.19,131.13 180 top
S45  L_Alt  [CHERRY-MX-4P]  117.32,131.13 180 top
S46  Space  [CHERRY-MX-4P]  160.81,131.76 180 top
S47  F7  [CHERRY-MX-4P]  197.64,234 180 top
S48  F8  [CHERRY-MX-4P]  216.69,234 180 top
S49  F9  [CHERRY-MX-4P]  243.36,234 180 top
S50  F10  [CHERRY-MX-4P]  262.41,234 180 top
S51  F11  [CHERRY-MX-4P]  281.46,234 180 top
S52  F12  [CHERRY-MX-4P]  300.51,234 180 top
S53  7  [CHERRY-MX-4P]  197.64,207.33 180 top
S54  8  [CHERRY-MX-4P]  216.69,207.33 180 top
S55  9  [CHERRY-MX-4P]  235.74,207.33 180 top
S56  0  [CHERRY-MX-4P]  254.79,207.33 180 top
S57  -  [CHERRY-MX-4P]  273.84,207.33 180 top
S58  =  [CHERRY-MX-4P]  292.89,207.33 180 top
S59  BS  [CHERRY-MX-4P]  333.53,207.33 180 top
S60  Y  [CHERRY-MX-4P]  197.64,188.28 180 top
S61  U  [CHERRY-MX-4P]  216.69,188.28 180 top
S62  I  [CHERRY-MX-4P]  235.74,188.28 180 top
S63  O  [CHERRY-MX-4P]  254.79,188.28 180 top
S64  P  [CHERRY-MX-4P]  273.84,188.28 180 top
S65  [  [CHERRY-MX-4P]  292.89,188.28 180 top
S66  ]  [CHERRY-MX-4P]  311.94,188.28 180 top
S67  |d  [CHERRY-MX-4P]  330.99,188.28 180 top
S67C  |u  [CHERRY-MX-4P]  311.94,207.33 180 top
S68  H  [CHERRY-MX-4P]  197.64,169.23 180 top
S69  J  [CHERRY-MX-4P]  216.69,169.23 180 top
S70  K  [CHERRY-MX-4P]  235.74,169.23 180 top
S71  L  [CHERRY-MX-4P]  254.79,169.23 180 top
S72  :  [CHERRY-MX-4P]  273.84,169.23 180 top
S73  "  [CHERRY-MX-4P]  292.89,169.23 180 top
S74  Del  [CHERRY-MX-4P]  336.07,234 180 top
S74A  Enter  [CHERRY-MX-4P]  324.01,169.23 180 top
S75  N  [CHERRY-MX-4P]  197.64,150.18 180 top
S76  M  [CHERRY-MX-4P]  216.69,150.18 180 top
S77  <  [CHERRY-MX-4P]  235.74,150.18 180 top
S78  >  [CHERRY-MX-4P]  254.79,150.18 180 top
S79  ~  [CHERRY-MX-4P]  273.84,150.18 180 top
S80  ?  [CHERRY-MX-4P]  292.89,150.18 180 top
S81  R Shift  [CHERRY-MX-4P]  324.01,150.18 180 top
S82  Space  [CHERRY-MX-4P]  208.76,131.13 180 top
S82A  space  [CHERRY-MX]  213.84,131.13 180 top
S83  FN3  [CHERRY-MX-4P]  268.76,131.13 180 top
S84  R_Alt  [CHERRY-MX-4P]  290.35,131.13 180 top
S85  RCtrl  [CHERRY-MX-4P]  315.75,130.49 180 top
S86  PrtScr  [CHERRY-MX-4P]  336.07,131.13 180 top
S87  FN2  [CHERRY-MX-4P]  247.17,131.13 180 top
S88  ~Ё  [CHERRY-MX-4P]  63.66,207.33 180 top
SCROLL  [LED5MM]  57.94,238.12 180 top
SV3  [FE13]  64.93,220.03 0 top
SV4  CON_KB_B  [FE12]  207.49,219.71 0 top
SV5  CON_KB_N  [FE09]  82.07,18.1 0 top
SV6  [FE12']  85.57,4.76 0 top
U$1  [18X18]  17.94,235.27 0 top
U$2  [18X18]  36.99,235.27 0 top
U$3  [18X18]  17.94,216.22 0 top
U$4  [18X18]  17.94,197.17 0 top
U$5  [18X18]  36.99,216.22 0 top
U$6  [18X18]  17.94,178.12 0 top
U$7  [18X18]  36.99,197.17 0 top
U$8  [18X18]  36.99,178.12 0 top
U$9  [18X18]  75.41,129.86 90 top
U$10  [18X18]  36.99,129.86 90 top
U$11  [18X18]  36.99,148.91 90 top
U$12  [18X18]  119.54,148.91 90 top
U$13  [18X18]  17.94,129.86 90 top
U$15  [SIZE132]  123.32,112.97 270 top
U$16  [18X23]  117.32,131.13 0 top
U$17  [18X52]  155.73,131.13 0 top
U$18  [18X18]  100.49,151.45 0 top
U$19  [18X18]  176.69,151.45 0 top
U$20  [18X18]  157.64,151.45 0 top
U$21  [18X18]  138.59,151.45 0 top
U$22  [18X37]  73.18,150.18 0 top
U$23  [18X18]  119.54,167.96 90 top
U$24  [18X18]  100.49,170.5 0 top
U$25  [18X18]  176.69,170.5 0 top
U$26  [18X18]  157.64,170.5 0 top
U$27  [18X18]  138.59,170.5 0 top
U$28  [18X33]  75.09,169.23 0 top
U$29  [18X18]  119.54,187.01 90 top
U$30  [18X18]  100.49,189.55 0 top
U$31  [18X18]  176.69,189.55 0 top
U$32  [18X18]  157.64,189.55 0 top
U$33  [18X18]  138.59,189.55 0 top
U$34  [18X28]  77.63,188.28 0 top
U$35  [18X18]  119.54,206.06 90 top
U$36  [18X18]  100.49,208.6 0 top
U$37  [18X18]  176.69,208.6 0 top
U$38  [18X18]  157.64,208.6 0 top
U$39  [18X18]  138.59,208.6 0 top
U$40  [18X18]  81.44,208.6 0 top
U$41  [18X18]  176.69,235.27 0 top
U$42  [18X18]  157.64,235.27 0 top
U$43  [18X18]  111.92,235.27 0 top
U$44  [18X18]  130.97,235.27 0 top
U$45  [18X18]  92.87,235.27 0 top
U$46  [18X18]  73.82,235.27 0 top
U$52  [18X42]  324.01,150.18 0 top
U$53  [18X18]  196.37,235.27 0 top
U$54  [18X18]  215.42,235.27 0 top
U$55  [18X18]  280.19,235.27 0 top
U$56  [18X18]  242.09,235.27 0 top
U$57  [18X18]  261.14,235.27 0 top
U$58  [18X18]  299.24,235.27 0 top
U$59  [18X18]  196.37,208.6 0 top
U$60  [18X18]  215.42,208.6 0 top
U$61  [18X18]  234.47,208.6 0 top
U$62  [18X18]  253.52,208.6 0 top
U$63  [18X18]  272.57,208.6 0 top
U$64  [18X18]  291.62,208.6 0 top
U$65  [18X18]  196.37,189.55 0 top
U$66  [18X18]  215.42,189.55 0 top
U$67  [18X18]  234.47,189.55 0 top
U$68  [18X18]  253.52,189.55 0 top
U$69  [18X18]  272.57,189.55 0 top
U$70  [18X18]  291.62,189.55 0 top
U$71  [18X18]  310.67,189.55 0 top
U$72  [18X18]  329.72,189.55 0 top
U$73  [18X18]  196.37,170.5 0 top
U$74  [18X18]  215.42,170.5 0 top
U$75  [18X18]  234.47,170.5 0 top
U$76  [18X18]  253.52,170.5 0 top
U$77  [18X18]  272.57,170.5 0 top
U$78  [18X18]  291.62,170.5 0 top
U$79  [18X18]  196.37,151.45 0 top
U$80  [18X18]  215.42,151.45 0 top
U$81  [18X18]  334.8,235.27 0 top
U$82  [18X18]  56.04,132.4 0 top
U$83  [18X18]  234.47,151.45 0 top
U$84  [18X18]  253.52,151.45 0 top
U$85  [18X18]  272.57,151.45 0 top
U$86  [18X18]  291.62,151.45 0 top
U$87  [18X52]  208.76,131.13 0 top
U$88  [18X18]  62.39,208.6 0 top
U$89  [18X18]  334.8,132.4 0 top
U$90  [18X23]  314.48,131.13 0 top
U$91  [18X23]  93.19,131.13 0 top
U$92  [18X23]  290.35,131.13 0 top
U$93  [18X23]  247.17,131.13 0 top
U$94  [18X42]  324.01,169.23 0 top
U$95  [18X18]  267.49,132.4 0 top
U$97  [SIZE132]  252.09,113.19 90 top
U$98  [18X18]  94.46,129.86 90 top
U$101  [18X18]  310.67,208.6 0 top
U$102  FE1.1S  [FE1.1S_SSOP-28]  78.26,25.08 0 top
U$103  [18X23]  333.53,207.33 0 top
U$105  [18X42]  213.84,131.13 180 top
Y1  16MHz KX-7  [CRYSTAL-3.2-2.5]  168.12,28.57 270 top
Y3  16MHz KX-7  [CRYSTAL-3.2-2.5]  72.55,11.11 0 top
Z1  CG0603MLC-05E  [CT/CN0603]  131.92,34.29 0 top
Z2  CG0603MLC-05E  [CT/CN0603]  131.92,40.64 0 top

## Tracks (layer width: path | path; a pad name or v marks a point on that pad's centre or on a via)
1
  Bottom 0.61: D3.C 28.3,220.46 30,220.03 30,213.04 28.73,211.77 26.6,211.14 J19.2 | J32.1 28.5,228.69 26.19,227.01 24.92,224.98 23.95,223.37
  Bottom 1.016: D1.C 23.95,223.37 26.19,221.3 D3.C
1J
  Bottom 0.61: J19.1 25.53,202.68 D5.C 28.94,201.41 30,200.34 30,193.36 28.73,192.09 25.96,192.09 J20.1
1J2
  Bottom 0.61: D7.C J20.2 22.61,185.74 J21.1
1J3
  Bottom 0.61: J21.2 11.99,183.6 10.32,178.12 10.32,174.94 11.59,173.35 11.59,165.42 9.68,162.56 9.68,155.37 D10.C
2
  Bottom 0.61: J16.2 48.42,210.5 47.35,211.57 D4.C D2.C J33.1
2I
  Bottom 0.406: 266.11,247.13 270.35,243.2 273.53,243.2 277.65,246.81 | 258.49,247.13 254.16,243.2 251.3,243.2 247.6,246.17 | 285.59,247.01 289.4,243.2 292.26,243.2 296.59,247.13
  Bottom 0.61: D50.C 225.38,242.05 226.54,242.89 233.41,242.89 237.01,246.17 247.6,246.17 | 266.11,247.13 258.49,247.13 | 296.59,247.13 310.24,247.13 311.94,243.52 J95.1 318.7,240.26 319.56,239.39 321.79,239.39 322.74,241.3 326.87,241.3 328.45,239.71 328.45,236.54 327.5,234.95 326.55,232.41 2D1.14 | 277.65,246.81 278.49,247.01 285.59,247.01
2J
  Bottom 0.61: J17.1 48.65,189.78 49.05,190.18 49.05,200.34 47.35,202.04 D6.C
  Bottom 1.016: J16.1 D6.C
2J2
  Bottom 0.61: D8.C 47.99,182.36 49.69,180.66 49.69,172.95 46.83,170.09 J18.1
  Bottom 1.016: D8.C J17.2
2J3
  Bottom 1.016: D9.C J18.2
3
  Bottom 0.61: J13.2 88.65,201.84 90.33,203.52 92.23,204.15 94.14,205.42 94.14,211.77 93.07,212.84 D19.C D13.C 87.99,221.5 87.15,220.66 82.07,220.66 78.9,223.84 70.41,223.84 J34.1
3J
  Bottom 0.61: D25.C 87.99,193.15 89.69,191.45 89.69,185.97 J14.1
  Bottom 1.016: J13.1 D25.C
3J2
  Bottom 1.016: J14.2 D31.C 84.5,175.26 90.33,175.26 91.28,174.31 91.28,164.78 89.6,163.11 J15.1
3J3  (1 unrouted)
  Bottom 0.61: 76.99,159.07 64.72,159.07 64.72,160.45 D11.C
  Bottom 1.016: J15.2 83.57,159.07 76.99,159.07
4
  Bottom 0.406: 118.9,219.71 125.02,219.71 J25.1
  Bottom 0.61: J10.2 110.24,204.38 113.19,206.06 113.19,210.5 111.49,212.2 D20.C 110.01,222.89 | 118.9,219.71 115.41,222.89 110.01,222.89 | 110.01,222.89 108.11,222.89 105.89,220.66 100.49,220.66 D14.C
4J
  Bottom 0.61: J10.1 106.84,196.96 D26.C 111.49,193.15 112.55,192.09 112.55,185.1 111.28,183.83 108.11,183.83 106.2,181.93 J11.1
4J2
  Bottom 0.61: J11.2 D32.C 111.49,174.1 113.19,172.4 113.19,166.69 111.92,165.42 109.38,165.42 106.43,163.11 J12.1
4J3
  Bottom 0.61: 92.23,145.73 83.98,145.73 80.49,142.24 73.93,142.24 D12.C
  Bottom 1.016: D38.C J12.2 105.16,159.07 96.68,159.07 94.14,155.26 94.14,147.64 92.23,145.73
5
  Bottom 0.406: 121.01,220.66 124.3,220.66 127.53,224.09 129.06,225.74 130.33,225.74 132.87,227.96 133.83,227.96 136.37,225.42 136.37,223.52 137.32,222.57 143.03,222.57 143.67,223.2
  Bottom 0.61: J7.2 126.12,201.84 128.43,203.52 130.33,203.52 131.6,206.06 131.6,208.6 D21.C 131.08,210.39 128.43,213.04 128.43,215.58 128.11,215.9 128.11,220.03 129.7,221.3 129.38,222.23 127.53,224.09 | 121.01,220.66 D15.C | 1D1.14 143.67,223.2
5J
  Bottom 0.61: J8.1 125.48,182.16 127.79,184.47 130.33,184.47 131.6,185.74 131.6,192.09 130.54,193.15 D27.C
  Bottom 1.016: J7.1 D27.C
5J2
  Bottom 0.61: J8.2 124.64,178.52 D33.C 130.54,174.1 131.6,173.04 131.6,166.05 130.97,165.42 127.79,165.42 J9.1
5J3
  Bottom 0.61: D43.C 109.38,146.37 112.55,146.37 112.55,155.26 116.36,159.07 124.21,159.07 J9.2
  Bottom 1.016: J9.2 D39.C
6
  Bottom 0.61: 150.65,214.11 150.65,206.06 J4.2 142.4,201.61 139.22,204.79 134.14,204.79 132.87,206.06 132.87,209.23 133.51,209.87 133.51,214.95 134.78,216.22 134.78,217.49 134.46,218.44 134.46,220.03 133.19,220.66 133.19,224.79 133.4,225.31 D16.C | 150.65,214.11 D22.C | 150.65,214.11 152.35,214.11 153.83,215.58 1D1.7
6J
  Bottom 0.61: J4.1 144.3,196.94 D28.C 150.65,191.88 150.65,185.1 149.38,183.83 146.84,183.83 143.9,181.52 J5.1
6J2
  Bottom 0.61: J5.2 146.21,176.01 D34.C 149.59,174.1 150.65,173.04 150.65,166.05 150.02,165.42 147.88,165.42 J6.2
6J3
  Bottom 0.61: J6.1 146.21,156.96 D40.C 150.02,153.99 150.02,147 148.11,147 D44.C
7
  Bottom 0.61: J1.2 164.62,196.3 D29.C 168.64,193.15 169.7,192.09 169.7,185.74 167.8,184.47 166.3,184.47 J2.1
7J  (1 unrouted)
  Bottom 0.61: D23.C 168.64,212.2 169.7,211.14 169.7,203.52 169.07,202.88 165.26,202.88 162.72,200.98 161.85,200.98 | 162.08,218.33 158.48,218.33 157.32,219.39 153.83,222.25 1D1.10 | D17.C 162.08,218.33 | 162.08,218.33 163.99,216.42
  Bottom 1.016: 163.99,216.42 D23.C
7J2
  Bottom 0.61: J2.2 163.99,177.91 D35.C 168.64,174.74 170.34,173.04 170.34,167.96 167.8,165.42 165.66,164.78 J3.2
7J3
  Bottom 0.61: D45.C 163.78,144.26 169.5,146.8 D41.C 169.52,153.96 165.05,157.14 J3.1
8
  Bottom 0.61: J23.1 185.37,220.66
  Bottom 1.016: D18.C 185.37,220.66 D24.C D30.C D36.C 185.06,145.53 180.18,141.6 180.18,140.02 D42.C D46.C
8J
  Bottom 0.61: D85.C 261.78,123.19 265.91,121.28 267.49,121.28 271.3,122.87 282.85,122.87 284.64,122.24 290.35,119.38 296.07,119.38 301.78,122.87 308.77,122.87 312.26,120.65 315.03,120.65 318.93,123.28 J87.1
  Bottom 1.016: 239.01,125.11 244.63,121.92 254.79,121.92 255.86,123.62 D89.C D85.C | 239.01,125.11 238.6,125.41 236.06,122.56 226.54,122.56 | 226.42,122.56 226.54,122.56 | D84.C 226.54,122.56 | D79.C 236.81,134.19 238.6,132.4 238.6,125.52 239.01,125.11
+3V3  (via drill 0.61)
  Top 0.305: 140.5,35.38 138.78,33.65 138.53,33.65 v137,32.13 | 146.91,19.05 145.82,18.09
  Top 0.406: 146.53,14.6 C14.2 | 146.53,14.6 147.16,15.24 147.16,18.92 146.91,19.05 v146.91,19.94 | v146.53,13.33 146.53,14.6
  Bottom 0.305: v137,32.13 137.13,32.13 137.26,32 137.51,32 146.91,22.61 v146.91,19.94
  Bottom 0.406: 154.78,3.81 148.43,10.16 142.72,10.16 142.08,10.8 142.08,12.07 142.72,12.7 145.89,12.7 v146.53,13.33
+3VD
  Top 0.61: C20.1 2D2.14
  Bottom 1.016: D92.C 2D2.14
+5V  (via drill 0.61, 0.81)  (21 unrouted)
  Top 0.305: v133.83,21.59 132.6,22.82 | IC2.8 139.2,36.83 v138.31,36.83 | RN1.5 150.38,10.2 149.7,9.52 149.7,9.12
  Top 0.406: 141.45,17.46 141.45,18.09 | 142.69,19.67 C11.2 | v181.45,6.35 179.55,6.35 177.64,8.26 177.64,12.07 176.37,13.33 | 144.22,9.12 C12.+ | D91.C 178.02,28.45 177.97,28.5 175.19,28.5 L1.1
  Top 0.61: 139.15,17.46 141.45,17.46 141.45,13.97 142.08,13.33 143.35,13.33 145.26,11.43 145.26,10.16 144.22,9.12 | v133.83,21.59 139.54,27.31 139.54,29.26 139.29,29.51 140.23,29.51 C13.1 142.21,31.5 v142.21,32.39 | C12.+ 149.7,9.12 153.28,9.12 157.32,5.08 157.32,5.71 | v174.47,29.84 L1.1
  Bottom 0.406: v142.21,32.39 141.45,32.39 138.27,35.56 138.27,36.54 v138.31,36.83
  Bottom 0.61: v174.47,29.84 178.91,29.84 181.45,32.39 183.99,32.39 185.26,31.12 ICSP.2 186.79,28.96 186.79,24.38 186.53,24.13 186.53,12.95 182.85,8.76 182.85,8.13 v181.45,6.35 180.82,5.71 169.39,5.71
  other vias: 128.11,21.59 133.83,13.33 130.02,21.59 131.92,21.59 135.1,17.14 128.11,13.33 130.02,13.33 131.92,13.33
  pour Bottom (isolate 0.406, no thermals): 135.24,25.02 arc-90 136.87,23.38 136.87,13.7 arc-90 135.24,12.7 126.57,12.7 arc-90 125.57,13.7 125.57,24.02 arc-90 126.57,25.02
+5V_B  (via drill 0.8 pad 2.3)  (1 unrouted)
  Top 0.61: SV4.11 218.92,228.28 228.76,228.28 v228.76,234.95 228.76,243.2 324.33,243.2 v324.33,239.08
  Bottom 0.61: R20.1 R19.1 R18.1 v226.22,205.42 | R17.1 v228.76,234.95 R21.1 R22.1
  Bottom 1.016: D93.A SV4.11 | v324.33,239.08 2D1.16 323.14,236.86 J86.2
  pour Bottom (no thermals): 217.8,219.87 217.8,220.82 220.03,220.82 220.03,219.71 219.39,218.6 217.8,218.6
A0
  Top 0.305: 170.02,3.18 169.39,3.81 166.85,3.81 163.81,6.84
A1
  Top 0.305: 164.61,7.32 167.48,4.45 171.29,4.45 172.56,3.18
A2
  Top 0.305: 168.12,5.08 173.2,5.08 175.1,3.18
A3
  Top 0.305: 168.75,5.71 175.1,5.71 177.64,3.18
A4
  Top 0.305: 169.39,6.35 177.01,6.35 180.18,3.18
A5
  Top 0.305: 170.02,6.99 177.64,6.99 180.18,4.45 181.45,4.45 182.72,3.18
AFN1A
  Bottom 1.016: JB44.2 S44.SW1 S44A.SW1
AFN1B
  Bottom 1.016: JA44.1 S44A.SW2 S44.SW2
AGND  (via drill 0.61)  (1 unrouted)
  Top 0.305: 175.74,10.8 176.36,10.16 C6.1 v176.37,11.79
  Bottom 0.406: v176.37,11.79 176.37,12.07
AREF  (via drill 0.61)  (2 unrouted)
  Top 0.305: v140.56,24.13 140.56,24.64 145.26,29.34 145.26,40.01 143.1,42.16 | 175.75,9.52 C6.2
  Bottom 0.305: v140.56,24.13 140.56,23.75 147.54,16.76 151.35,16.76 152.24,15.88 158.59,15.88
AVCC  (via drill 0.61)  (4 unrouted)
  Top 0.305: 158.59,20.32 158.59,21.72 | v182.72,18.41 v182.72,13.33
  Bottom 0.305: 175.99,19.05 177.89,20.95 180.18,20.95 v182.72,18.41 | 179.8,7.62 181.2,9.02 181.2,11.81 v182.72,13.33
B1
  Bottom 0.406: D58.C 259.87,214.95 258.29,215.58 258.29,220.03 258.6,220.34 258.6,222.25 258.92,222.57 258.92,226.06 | 266.22,242.25 269.08,240.35 274.48,240.35 277.65,242.25 | 258.49,242.25 257.02,241.62 D52.C | 285.59,242.25 288.13,240.35 293.85,240.35 296.82,242.68
  Bottom 0.61: 296.82,242.68 305.91,242.68 D54.C 308.29,239.08 308.93,238.44 310.36,238.44 310.99,238.76 317.98,238.76 318.61,237.81 318.61,234.32 2D1.15 325.91,234.79 D64B.C | 258.92,226.06 252.89,229.23 | 258.49,242.25 266.22,242.25 | 277.65,242.25 285.59,242.25
  Bottom 0.813: D52.C 252.89,238.55 D51.C
  Bottom 1.016: 252.89,229.23 252.89,238.55
B2
  Bottom 0.61: J53.2 D60.C | D61.C 299.92,212.36 297.34,215.9 | 297.34,224.36 297.34,217.96
  Bottom 0.813: 297.34,224.36 297.34,225.42 292.89,229.87 288.77,229.87 287.5,228.6 D53.C
  Bottom 1.016: D60.C 287.81,215.9 297.34,215.9 297.34,217.96 | J46.2 297.34,225.42
B2J
  Bottom 0.61: 250.87,199.39 254.48,199.39 256.7,201.61 262.1,201.61 265.59,203.52 265.59,207.01 267.81,211.45 267.81,213.84 269.56,215.9 278.29,215.9 279.88,213.68 J53.1
  Bottom 0.813: 250.87,199.39 248.76,201.61 D57.C
B3
  Bottom 0.61: D59.C 271.3,196.53 269.29,196.53 D65.C 262.94,192.2 259.24,197.17 250.35,197.17 246.54,191.45 243.68,191.45 240.62,196.74 230.87,196.74 227.17,192.4 225.27,192.4 222.41,196.21 221.46,196.85 217.33,196.85 | D49.C 210.14,194.42 212.57,196.85 217.33,196.85 | D56.C 217.33,196.85
  Bottom 1.016: D59.C J48.2
B3J
  Bottom 0.61: 302.1,201.93 300.74,201.93 J49.1 | 302.1,201.93 303.85,201.93 308.13,197.49 312.58,197.49 314.47,198.78 | D68.C 319.25,184.99 319.25,190.18 317.98,191.45 317.98,194.63 316.39,196.53 314.47,198.78 | D67B.C 302.1,201.93 | J88.1 320.6,202.97 314.47,198.78
B4
  Bottom 0.61: D76.C 300.08,174.74 296.5,178.32
  Bottom 0.813: 287.18,176.62 288.36,177.8 294.48,177.8 D67.C | J91.1 297.13,181.93 D67.C | 296.5,178.32 D67.C
  Bottom 1.016: J50.1 287.18,176.62
B4J
  Bottom 0.61: J50.2 280.6,175.17 276.38,179.39 D66.C 273.64,177.48 268.76,177.48 265.59,174.31 D73.C 263.25,174.1 257.33,180.02 250.67,180.02 247.81,182.88 244.63,182.88 242.73,181.29 J54.2
B4J2
  Bottom 0.61: J54.1 236.15,180.02 233.2,180.02 226.85,173.67 225.7,173.67 D63.C 219.98,178.55 219.23,178.44 216.38,178.44 D55.C
B5
  Bottom 1.016: J51.1 284.39,154.53 288.77,159.39 | D75.C 288.77,159.39 | 288.77,159.39 292.98,159.39 J89.1
B5J
  Bottom 0.61: J51.2 279.17,157.35 278.08,158.43 268.76,158.43 | 268.76,158.43 266.22,155.89 263.37,155.89 258.6,160.97 249.87,160.97 247.01,164.15 243.84,164.15 | 268.76,158.43 D74.C | D64.C 238.53,177.87 240.82,176.85 243.68,173.35 244,173.04 243.84,164.15 | 243.84,164.15 240.66,160.65 231.62,160.65 230.98,161.29 228.55,163.4 D71.C 224.52,164.03 221.77,161.29 D62.C
B5J4
  Bottom 0.61: J92.1 325.6,163.83 321.79,160.02 308.77,160.02 303.69,164.15 302.1,164.15 298.61,162.24 J89.2
B5J5
  Bottom 0.61: J92.2 334.8,165.03 334.8,176.1 D69.C 334.6,177.8 336.39,177.8 339.25,183.83 339.25,199.07 344.01,203.68 344.01,212.09 340.16,219.75 328.77,219.71 2D1.10
B6
  Bottom 0.61: J55.2 273.41,139.27 D81.C 277.22,139.27 283.69,145.73 285.59,145.73 290.67,139.7
  Bottom 0.813: 290.67,139.7 296.07,139.7 D82.C
  Bottom 1.016: D82.C 299.99,146.05 303.78,146.05 J94.1
B6J2
  Bottom 0.61: 245.59,154.94 247.17,154.94 250.24,158.96 258.71,158.96 262.73,154.62 262.73,152.08 266.86,147.95 266.86,145.57 J55.1 | 245.59,154.94 243.36,154.94 240.42,158.84 D72.C | 245.59,154.94 245.59,149.54 242.09,146.05 240.42,144.78 J56.2
B6J3
  Bottom 0.61: J56.1 228.21,145.1 224.63,145.1 222.41,142.56 220.5,142.56 D70.C
B6J4
  Bottom 1.016: J93.1 322.51,141.6 312.58,141.6 D83.C J94.2
B7
  Bottom 0.61: 343.38,120.97 336.07,120.97 327.18,124.78 317.98,124.78 314.48,122.24 312.58,122.24 309.4,124.46 304.32,124.46 302.94,125.52 D87.C 294.59,120.97 289.92,120.97 281.46,124.98 D86.C 276.81,124.46 270.99,124.46 267.38,123.08 265.38,123.08 263.37,124.14 261.14,127 259.87,128.9 257.65,128.9 257.02,129.54 257.02,132.4 260.19,133.99 260.19,136.75 J52.1 | 346.87,133.99 345.6,136.52 341.79,147 341.79,177.16 344.01,181.29 344.01,198.28 348.77,202.88 348.77,213.36 342.42,224.79 332.58,224.79 326.55,228.92 2D1.13
  Bottom 1.016: 346.87,133.99 346.87,126.37 343.38,120.97
B7J
  Bottom 0.61: D77.C 208.64,144.26 213.2,139.7 220.93,139.7 D78.C 221.46,138.43 224,135.89 233.84,135.89 237.65,139.7 238.28,141.6 243.36,145.41 247.81,145.41 D80.C 250.67,139.38 252.25,139.38 J52.2
B8
  Bottom 0.61: 344.01,133.99 343.06,137.8 340.2,146.69 340.2,177.8 342.42,181.93 342.42,198.6 347.19,203.2 347.19,213.04 341.79,223.2 330.36,223.2 325.91,226.38 2D1.12 | D88.C 342.54,123.62 341.47,122.56 335.12,122.56 330.45,124.69 J87.2
  Bottom 1.016: 344.01,133.99 344.01,127.84 D88.C
BD1
  Bottom 0.406: SV4.10 216.38,220.98 217.33,221.62 220.19,221.62 221.14,220.5 222.73,219.71 224,220.66 233.68,220.66 234.47,220.34 242.25,220.34 244.32,220.98 247.01,220.98
  Bottom 0.61: 247.01,220.98 250.03,218.44 254.63,218.44 J70.2
BD2
  Bottom 0.406: SV4.9 213.84,220.98 216.69,222.57 218.28,222.57 220.82,224.79 221.46,224.79 224.63,221.62 242.09,221.62 244.47,222.25 247.65,222.25 250.51,219.71 | 254.79,219.71 255.9,220.82 J71.2
  Bottom 0.61: 254.79,219.71 250.51,219.71
BD3
  Bottom 0.406: SV4.8 211.3,221.62 212.57,222.57 214.15,222.57 216.38,223.52 217.8,223.52 220.5,225.9 221.61,225.9 224.95,222.57 241.93,222.57 244,223.52 248.13,223.52 | 251.14,220.82 253.84,220.82 255.27,221.77 J72.2
  Bottom 0.61: 251.14,220.82 248.13,223.52
CD1  (1 unrouted)
CD2  (1 unrouted)
CD3  (1 unrouted)
CMP  (1 unrouted)
  Top 0.305: RN1.8 150.27,19.62 | RN1.8 150.21,19.78 150.21,20.32 148.18,22.35 140.3,22.35 139.54,23.11 139.54,24.64 144.62,29.72 144.62,34.29 142.72,36.2 141.36,36.2 | C22.2 141.19,37.97 141.15,37.93 | RN1.8 151.04,19.62 151.23,19.43 151.23,18.92 151.12,18.82 RN1.7
D0/RX  (via drill 0.61)
  Bottom 0.305: v163.04,27.94 163.04,29.21 182.72,48.89
D1  (1 unrouted)
D1/TX
  Bottom 0.305: 161.77,29.21 180.18,47.63
D2  (1 unrouted)
D2/SDA  (via drill 0.61)
  Top 0.305: 164.61,28.27 163.04,29.84 161.77,29.84 v161.13,30.48 160.5,29.84 147.8,29.84 v147.16,30.48 | v140.81,42.55 140.81,50.55
  Bottom 0.305: v140.81,42.55 140.81,42.42 140.94,42.29 140.94,37.21 147.16,30.99 v147.16,30.48 | v161.13,30.48 161.77,30.48 177.64,46.35
D3  (1 unrouted)
D3/SCL  (via drill 0.61)
  Top 0.305: v137.64,42.55 138.02,42.93 | v147.41,32.39 149.32,30.48 158.59,30.48 v161.13,33.02 165.41,28.74
  Bottom 0.305: v137.64,42.55 138.91,43.82 141.45,43.82 142.08,43.18 142.08,41.91 141.7,41.4 141.7,37.59 146.91,32.39 v147.41,32.39 | v161.13,33.02 161.13,37.46 172.56,48.89 174.47,48.89 175.1,49.53
D4  (via drill 0.61)  (1 unrouted)
  Top 0.305: 157.96,23.75 157.96,19.69 158.73,18.91
  Bottom 0.305: v159.86,27.94 159.86,28.57 158.59,29.84 158.59,36.2 172.56,50.16
D5*  (via drill 0.61)  (1 unrouted)
  Top 0.305: 158.6,13.47 155.15,13.47 153.51,15.11 153.51,23.5 v150.34,26.67
  Bottom 0.305: 169.39,50.16 169.39,48.26 157.7,36.58 157.7,29.46 158.59,28.57 158.59,26.67 | 158.34,24.13 157.32,24.13 156.69,24.76 152.24,24.76 v150.34,26.67
D6*  (via drill 0.61)
  Top 0.305: 158.04,17.31 156.69,18.67 156.69,25.65 157.32,26.29 v157.32,27.94
  Bottom 0.305: v157.32,27.94 157.32,28.57 156.81,29.46 156.81,36.96 167.48,47.63
D7  (via drill 0.61)
  Top 0.305: v156.69,17.14 156.05,17.78 v156.05,26.67
  Bottom 0.305: 164.94,46.35 155.92,37.34 155.92,29.08 156.05,28.57 v156.05,26.67
D+
  Top 0.305: RN3.8 130.72,36.26 130.65,36.2 130.65,34.65 Z1.1
  Top 0.406: J47.P3 127.1,38.1 129,36.2 129.02,36.2 Z1.1
D-
  Top 0.305: RN3.5 130.72,38.66 130.65,38.74 130.65,40.27 Z2.1
  Top 0.406: Z2.1 129.68,38.76 J47.P2
G1
  Bottom 0.61: JA49.2 236.06,235.78 236.06,238.13 233.84,238.13 233.2,237.97 231.62,237.97 230.98,239.08 R17.2 228.44,239.08 226.54,239.08 225.58,240.35 223.04,240.35 221.46,243.52
  Bottom 0.813: JA49.2 236.25,229.36 238.6,226.38 2D2.9 | JA47.2 189.71,227.77 189.71,214.63 190.53,213.36
  Bottom 1.016: JA47.2 190.53,241.54 195.1,243.52 203.36,243.52 207.17,239.71 | 190.53,213.49 190.53,213.36 JA53.2 JA60.2 JA68.2 JA75.2 190.53,143 191.61,141.92 195.42,141.92 199.55,139.7 201.64,137.6 JA82.2 | 207.17,239.71 JA48.2 | 221.46,243.52 210.98,243.52 207.17,239.71
G2
  Bottom 0.61: JA56.2 244.32,204.47 241.14,201.61 JA55.2 237.65,200.34 237.65,198.12 231.46,198.12 227.17,202.88 223.68,202.88 | JA70.2 227.68,166.18 224.95,166.18 221.01,163.2 219.87,163.2 | 211.3,198.63 210.98,197.17 208.44,194.31 208.44,187.96 209.58,186.5 JA61.2 209.42,184.12 212.09,181.29 213.84,180.02 213.84,177.8 211.77,177.16 210.66,176.05 210.66,172.4 209.07,171.13 209.07,167.96 209.58,167.45 JA69.2 209.58,164.59 213.2,160.97 215.11,160.97 217.33,163.2 219.87,163.2 | 211.3,198.63 JA54.2 | 219.87,163.2 219.87,159.39 222.09,157.48 228.12,152.4 228.12,149.54 JA77.2 JA76.2 | 223.68,202.88 223.36,200.98 222.09,199.71 220.06,198.63 211.3,198.63 | J63.2 R18.2 223.68,205.74 223.68,202.88
G3
  Bottom 0.61: JA71.2 247.68,171.26 241.46,178.12 239.55,179.39 239.55,182.25 240.82,182.56 242.08,182.56 244.09,184.58
  Bottom 1.016: J57.2 JA62.2 | JA62.2 JA63.2 | 244.09,184.58 JA62.2
G4
  Bottom 0.406: J76.2 260.67,215.58 262.73,213.36 266.22,213.36 269.4,217.49
  Bottom 0.61: JA64.2 282.23,192.6 277.34,198.12 277.34,200.66 279.56,202.25 281.91,203.64 JA57.2 282.1,212.41 279.24,216.85 278.61,217.49 | JA72.2 282.1,175.58 279.24,178.44 279.24,180.66 | 278.61,161.61 278.61,160.18 282.57,154.31 282.57,147.83 JA79.2 282.54,146.65 276.54,140.65 274.16,140.65 271.94,142.24 269.72,140.02 269.08,140.02 267.81,141.29 267.81,142.56 264.95,145.41 260.83,145.41 259.43,143.07 JA78.2 258.73,137.67 258.73,135.57 255.11,133.86 JA87.2 | 269.4,217.49 278.61,217.49 | JA51.2 274.35,227.77 276.07,226.06 277.65,226.06 278.29,225.42 278.29,217.81 278.61,217.49
  Bottom 1.016: JA51.2 JA50.2 | JA64.2 282.23,183.96 279.24,180.66 | JA72.2 282.23,165.23 278.61,161.61
G5
  Bottom 0.406: 310.2,235.99 310.2,231.96